# EAGLE design main (EAGLE 9.6.2)
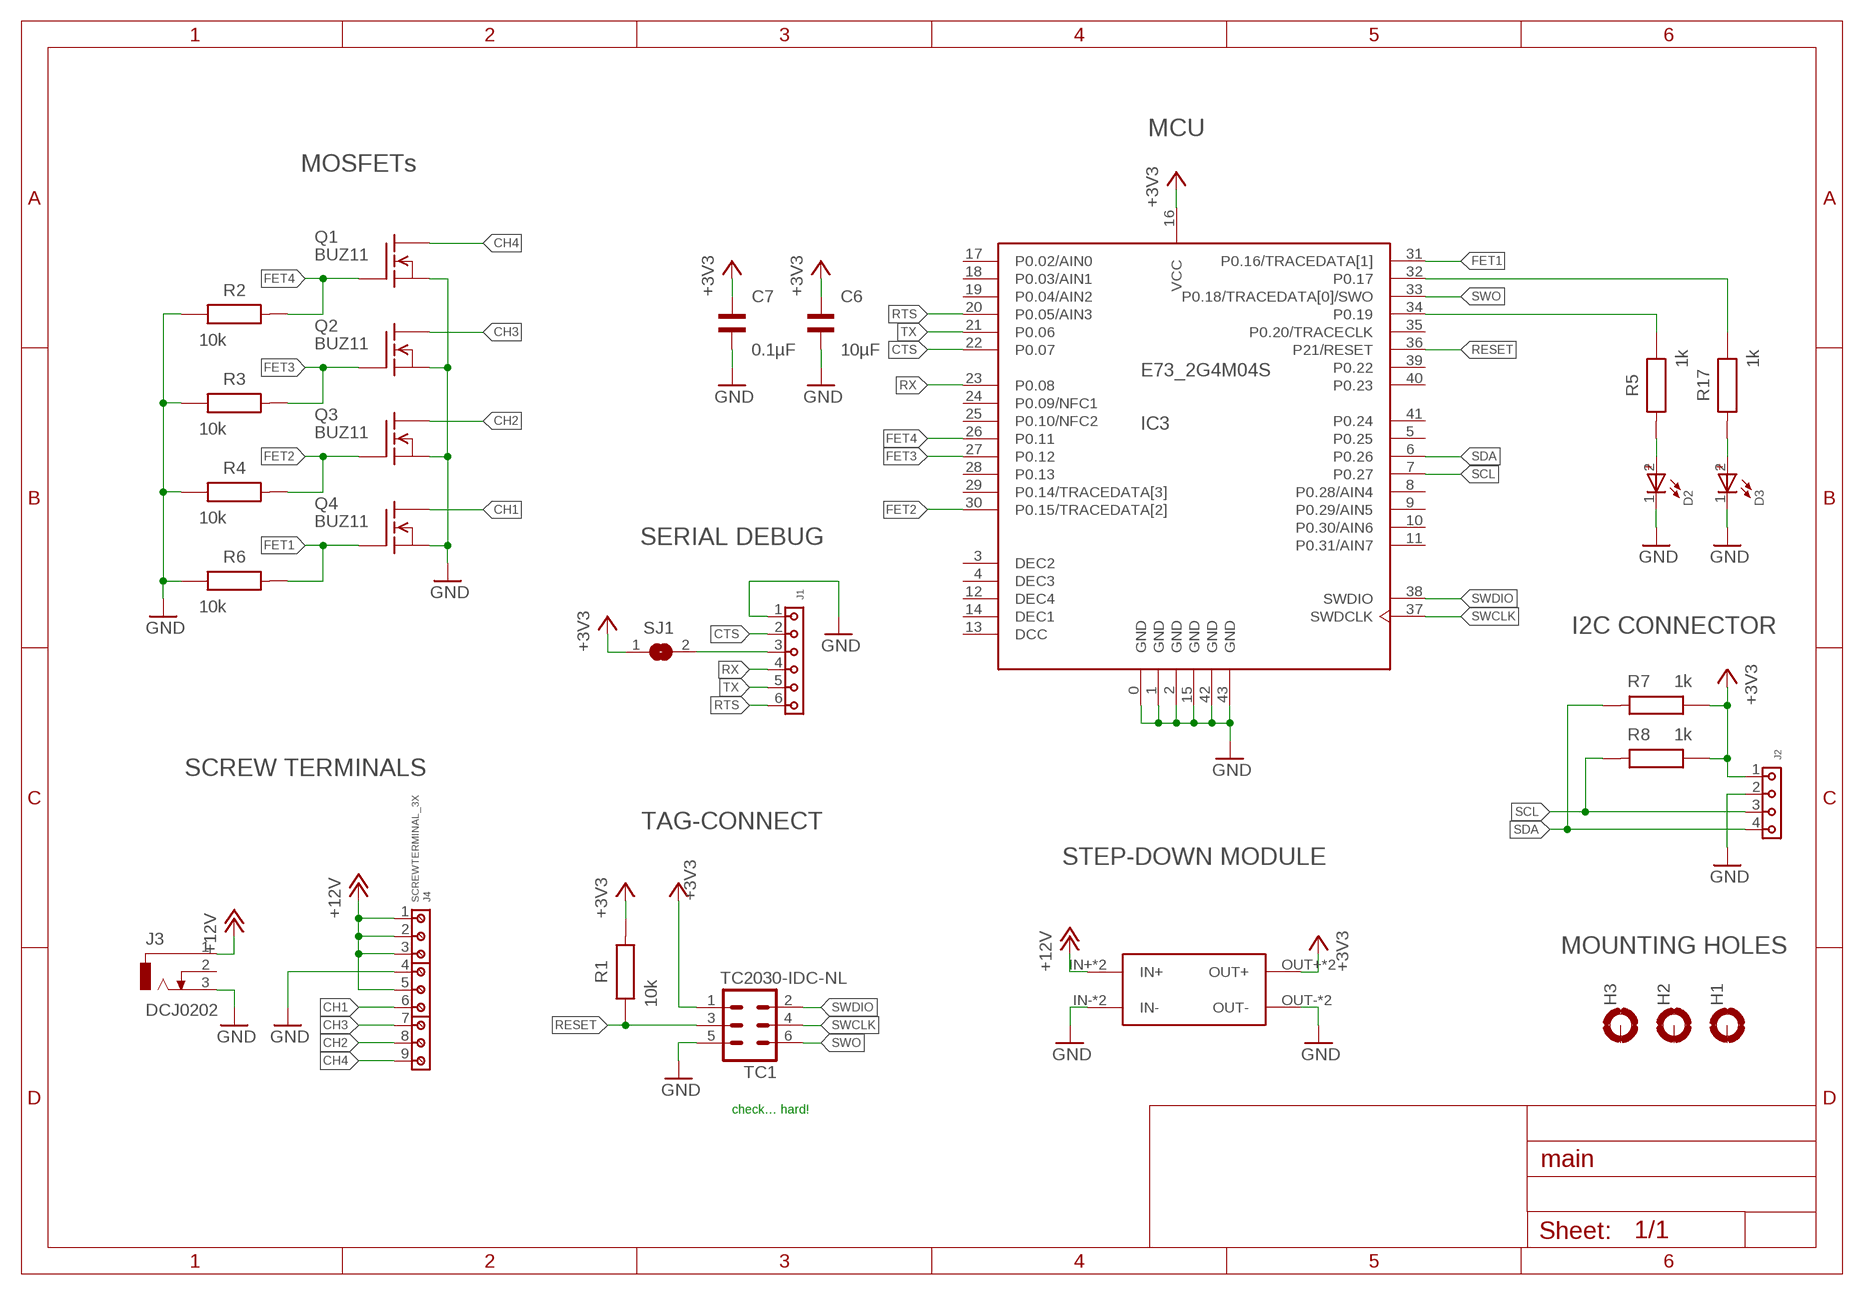
[diagram p0: schematic, sheet 1]

## Parts
C6  10µF  WCAP-CSGP_0603_885012206046_REFLOW  [WCAP-CSGP_0603_REFLOW]
C7  0.1µF  WCAP-CSGP_0603_885012206046_REFLOW  [WCAP-CSGP_0603_REFLOW]
D2  WL-SMCW_0603_150060BS75000  [WL-SMCW_0603]
D3  WL-SMCW_0603_150060BS75000  [WL-SMCW_0603]
H1  MOUNT-PAD-ROUND3.2  [3,2-PAD]
H2  MOUNT-PAD-ROUND3.2  [3,2-PAD]
H3  MOUNT-PAD-ROUND3.2  [3,2-PAD]
IC3  E73_2G4M04S  [E73_2G4M04S]
J1  6130XX11821_61300611821  [61300611821]
J2  6130XX11821_61300411821  [61300411821]
J3  DCJ0202  [DCJ0202]
J4  SCREWTERMINAL_3X  [691102710003]
Q1  BUZ11  [TO220]
Q2  BUZ11  [TO220]
Q3  BUZ11  [TO220]
Q4  BUZ11  [TO220]
R1  10k  WRIS-PSMB_0603_580060716001_1.6X0.8X0.35X0.6  [WRIS-PSMB_0603_1.6X0.8X0.35X0.6(LXWXHXPW)]
R2  10k  WRIS-PSMB_0603_580060716001_1.6X0.8X0.35X0.6  [WRIS-PSMB_0603_1.6X0.8X0.35X0.6(LXWXHXPW)]
R3  10k  WRIS-PSMB_0603_580060716001_1.6X0.8X0.35X0.6  [WRIS-PSMB_0603_1.6X0.8X0.35X0.6(LXWXHXPW)]
R4  10k  WRIS-PSMB_0603_580060716001_1.6X0.8X0.35X0.6  [WRIS-PSMB_0603_1.6X0.8X0.35X0.6(LXWXHXPW)]
R5  1k  WRIS-PSMB_0603_580060716001_1.6X0.8X0.35X0.6  [WRIS-PSMB_0603_1.6X0.8X0.35X0.6(LXWXHXPW)]
R6  10k  WRIS-PSMB_0603_580060716001_1.6X0.8X0.35X0.6  [WRIS-PSMB_0603_1.6X0.8X0.35X0.6(LXWXHXPW)]
R7  1k  WRIS-PSMB_0603_580060716001_1.6X0.8X0.35X0.6  [WRIS-PSMB_0603_1.6X0.8X0.35X0.6(LXWXHXPW)]
R8  1k  WRIS-PSMB_0603_580060716001_1.6X0.8X0.35X0.6  [WRIS-PSMB_0603_1.6X0.8X0.35X0.6(LXWXHXPW)]
R17  1k  WRIS-PSMB_0603_580060716001_1.6X0.8X0.35X0.6  [WRIS-PSMB_0603_1.6X0.8X0.35X0.6(LXWXHXPW)]
SJ1  SJ  [SJ]
TC1  TC2030-IDC-NL  [TC2030-IDC-NL]
U$1  LM2596-MODULE  [LM2596-MODULE]

## Nets
+3V3: C6.2 C7.2 IC3.16(VCC) J2.1 R1.2 R7.1 R8.1 SJ1.1 TC1.1 U$1.OUT+ U$1.OUT+1(OUT+)
+12V: J3.1 J4.1 J4.2 J4.3 J4.5 U$1.IN+ U$1.IN+1(IN+)
CH1: J4.6 Q4.2(D)
CH2: J4.8 Q3.2(D)
CH3: J4.7 Q2.2(D)
CH4: J4.9 Q1.2(D)
CTS: IC3.22(P0.07) J1.2
FET1: IC3.31(P0.16/TRACEDATA[1]) Q4.1(G) R6.2
FET2: IC3.30(P0.15/TRACEDATA[2]) Q3.1(G) R4.2
FET3: IC3.27(P0.12) Q2.1(G) R3.2
FET4: IC3.26(P0.11) Q1.1(G) R2.2
GND: C6.1 C7.1 D2.1(-) D3.1(-) IC3.0(GND) IC3.1(GND) IC3.2(GND) IC3.15(GND) IC3.42(GND) IC3.43(GND) J1.1 J2.2 J3.3 J4.4 Q1.3(S) Q2.3(S) Q3.3(S) Q4.3(S) R2.1 R3.1 R4.1 R6.1 TC1.5 U$1.IN- U$1.IN-1(IN-) U$1.OUT- U$1.OUT-1(OUT-)
N$4: J1.3 SJ1.2
N$18: D2.2(+) R5.2
N$19: D3.2(+) R17.2
N$20: IC3.32(P0.17) R17.1
N$21: IC3.34(P0.19) R5.1
RESET: IC3.36(P21/RESET) R1.1 TC1.3
RTS: IC3.20(P0.05/AIN3) J1.6
RX: IC3.23(P0.08) J1.4
SCL: IC3.7(P0.27) J2.3 R8.2
SDA: IC3.6(P0.26) J2.4 R7.2
SWCLK: IC3.37(SWDCLK) TC1.4
SWDIO: IC3.38(SWDIO) TC1.2
SWO: IC3.33(P0.18/TRACEDATA[0]/SWO) TC1.6
TX: IC3.21(P0.06) J1.5
Unconnected: H1.B3,2(MOUNT) H2.B3,2(MOUNT) H3.B3,2(MOUNT) IC3.5(P0.25) IC3.8(P0.28/AIN4) IC3.9(P0.29/AIN5) IC3.10(P0.30/AIN6) IC3.11(P0.31/AIN7) IC3.17(P0.02/AIN0) IC3.18(P0.03/AIN1) IC3.19(P0.04/AIN2) IC3.24(P0.09/NFC1) IC3.25(P0.10/NFC2) IC3.28(P0.13) IC3.29(P0.14/TRACEDATA[3]) IC3.35(P0.20/TRACECLK) IC3.39(P0.22) IC3.40(P0.23) IC3.41(P0.24) J3.2

## Notes on the sheet
- MCU
- MOSFETs
- SERIAL DEBUG
- I2C CONNECTOR
- SCREW TERMINALS
- TAG-CONNECT
- STEP-DOWN MODULE
- MOUNTING HOLES
- check… hard!

## Power pins joined to a net without a drawn wire
DCC: IC3.13(DCC)
DEC1: IC3.14(DEC1)
DEC2: IC3.3(DEC2)
DEC3: IC3.4(DEC3)
DEC4: IC3.12(DEC4)

## Library data of the parts
C6 C7 = 885012206052_Eagle_WCAP-CSGP_rev19b (1):WCAP-CSGP_0603: WCAP-CSGP Ceramic Capacitors Characteristics Multilayer Ceramic Chip Capacitor Recommended soldering:Reflow, for 0603 and 0805 wave soldering is also allowed Operating temperature:-55 °C to +125 °C; Ceramic characteristics: Class I - NPO ; Class II -X7R, X5R High performance ceramic High capacitance stability Minimal aging Termination:Cu/Ni/Sn <http://katalog.we-online.de/media/images/eisos/WCAP-CSGP_pf2.jpg> Details see: http://katalog.we-online.de/en/pbs/WCAP-CSGP-0603? Created: 2015-01-28 2015 (C) Wurth Elektronik
D2 D3 = 150080BS75000_Eagle_WL-SMCW_rev20b:WL-SMCW_0603: WL-SMCW SMT Mono-color Chip LED Waterclea Characteristics Low energy consumption High reliability Low current requirement Fast switching No UV/IR radiation Smallest SMD LED package for exceptional brightness Top view LED Wide viewing angle Better solder ability Heat dissipation Applications Backlight for mobile and portable device keypads Indoor and outdoor message boards Flat backlight for LCDs, switches and symbols Display for industrial control systems and traffic Miniaturized color effects Pedestrian mark Optical indicators Tabular backlight: LCD, telephone key-press, power-switch, display board Indoor displays Signals Identifiers Backlight for automobile DVD LED General lighting Toys <https://www.we-online.com/catalog/media/o14904v209%20Family_WL-SMCW.jpg> Details see: https://www.we-online.com/catalog/en/WL-SMCW/ Updated BY Yingchun,Shan 2020-03-18 2020(C) Wurth Elektronik; ABSTRAHLWINKEL: 140°; CHIP-TECHNOLOGY: InGaN; DATASHEET-URL: https://www.we-online.com/catalog/datasheet/150060BS75000.pdf; EMITTING-COLOR: Blue; I-V-TYP: 145mcd; LAMDA-DOM-TYP: 470nm; LAMDA-PEAK-TYP: 465nm; PART-NUMBER: 150060BS75000; V-F-TYP: 3.2V
H1-H3 = holes:MOUNT-PAD-ROUND: MOUNTING PAD, round
IC3 = E73-2G4M04S:E73_2G4M04S: E73-2G4M04S nRF52832 based BLE module
J1 = 61300611821_Eagle_WR-PHD_rev19a:6130XX11821_61300611821: WR-PHD 2.54 mm Socket Header ARTICLE PROPERTIES: Pins:1;​ 2;​ 3;​ 4;​ 5;​ 6;​ 7;​ 8;​ 9;​ 10;​ 12;​ 13;​ 14;​ 15;​ 16;​ 18;​ 20;​ 22;​ 24;​ 25;​ 32;​ 36;​ 40 KIND PROPERTIES: Pitch：2.54 mm Quality Class:3 as per CECC 75 301-802 Rows：Single Gender：Socket Header;​ Female Type：Straight MATERIAL PROPERTIES: Insulator Material :PBT Insulator Flammability Rating:UL94 V-0 Contact Material:Copper Alloy Contact Plating:Gold Contact Type:Stamped GENERAL INFORMATION Operating Temperature:-40 up to +125 °C Compliance:Lead free / RoHS ELECTRICAL PROPERTIES: Rated Current:3 A IR 1:3 A Withstanding Voltage:500 V (AC) Contact Resistance:20 mΩ RISO:1000 MΩ CERTIFICATION UL Approval:E323964 PACKAGING PROPERTIES Packaging:Tray <https://katalog.we-online.com/media/images/v2/o33218v209%20Family_WR-PHD_613xxx11821.jpg> Details see: https://katalog.we-online.com/en/em/PHD_2_54_SOCKET_HEADER_6130XX11821 Updated by Yingchun,Shan 2019-10-21 2019 (C) Würth Elektronik; DATASHEET-URL: https://katalog.we-online.com/em/datasheet/61300611821.pdf; GENDER: Socket Header; IR: 3A; MATES: WR-PHD 2.54mm SMT Pin Header/THT Angled Pin Header/THT Pin Header; PACKAGING: Tray; PART-NUMBER: 61300611821; PINS: 6; ROWS: Single; TYPE: Straight
J2 = 61300611821_Eagle_WR-PHD_rev19a:6130XX11821_61300411821: WR-PHD 2.54 mm Socket Header ARTICLE PROPERTIES: Pins:1;​ 2;​ 3;​ 4;​ 5;​ 6;​ 7;​ 8;​ 9;​ 10;​ 12;​ 13;​ 14;​ 15;​ 16;​ 18;​ 20;​ 22;​ 24;​ 25;​ 32;​ 36;​ 40 KIND PROPERTIES: Pitch：2.54 mm Quality Class:3 as per CECC 75 301-802 Rows：Single Gender：Socket Header;​ Female Type：Straight MATERIAL PROPERTIES: Insulator Material :PBT Insulator Flammability Rating:UL94 V-0 Contact Material:Copper Alloy Contact Plating:Gold Contact Type:Stamped GENERAL INFORMATION Operating Temperature:-40 up to +125 °C Compliance:Lead free / RoHS ELECTRICAL PROPERTIES: Rated Current:3 A IR 1:3 A Withstanding Voltage:500 V (AC) Contact Resistance:20 mΩ RISO:1000 MΩ CERTIFICATION UL Approval:E323964 PACKAGING PROPERTIES Packaging:Tray <https://katalog.we-online.com/media/images/v2/o33218v209%20Family_WR-PHD_613xxx11821.jpg> Details see: https://katalog.we-online.com/en/em/PHD_2_54_SOCKET_HEADER_6130XX11821 Updated by Yingchun,Shan 2019-10-21 2019 (C) Würth Elektronik; DATASHEET-URL: https://katalog.we-online.com/em/datasheet/61300411821.pdf; GENDER: Socket Header; IR: 3A; MATES: WR-PHD 2.54mm SMT Pin Header/THT Angled Pin Header/THT Pin Header; PACKAGING: Tray; PART-NUMBER: 61300411821; PINS: 4; ROWS: Single; TYPE: Straight
J3 = con-jack:DCJ0202: DC POWER JACK Source: DCJ0202.pdf; OC_FARNELL: unknown; OC_NEWARK: unknown
J4 = Eigene Bauteile:SCREWTERMINAL_3X
Q1-Q4 = transistor-fet:BUZ11: N-Channel Enhancement MOSFET 50V; 30A; 0,040Ohm
R1-R8 R17 = 580060716001_Eagle_WRIS-PSMB_rev19a:WRIS-PSMB_0603: WRIS-PSMB Metal Plate Resistors Characteristics Metal plate resistors Recommended soldering: Reflow Operating temperature: -55 °C up to +155 °C Resistance range: 5 mΩ up to 10 mΩ Resistance tolerance: ±1 % Rated power: 0.33 W up to 1 W Enhanced current sensing Applications DMotor control Package name and Variant abbreviation: L X W X H X PW =Length X Width X Height X Pad Width <https://katalog.we-online.com/media/images/v2/o135743v209%20Family_WRIS-PSMB.jpg> Details see: https://katalog.we-online.com/en/pbs/WRIS-PSMB Created by Yingchun, Shan 2018-11-14 2018(C) Wurth Elektronik; DATASHEET-URL: https://katalog.we-online.de/pbs/datasheet/580060716001.pdf; IR: 8.12A; MOUNT: SMT; PART-NUMBER: 580060716001; PRATED: 0.33W; TCR: ±100ppm/ °C; TECHNICAL-REFERENCE: MB0603R005F103KAATP0000; VALUE: 5mOhm
SJ1 = jumper:SJ: SMD solder JUMPER
TC1 = TagConnect:TC2030-IDC: Tag-Connect In Circuit Programming & Debug Cable 6 Pin http://www.tag-connect.com
U$1 = Lib_A:LM2596-MODULE

## Board
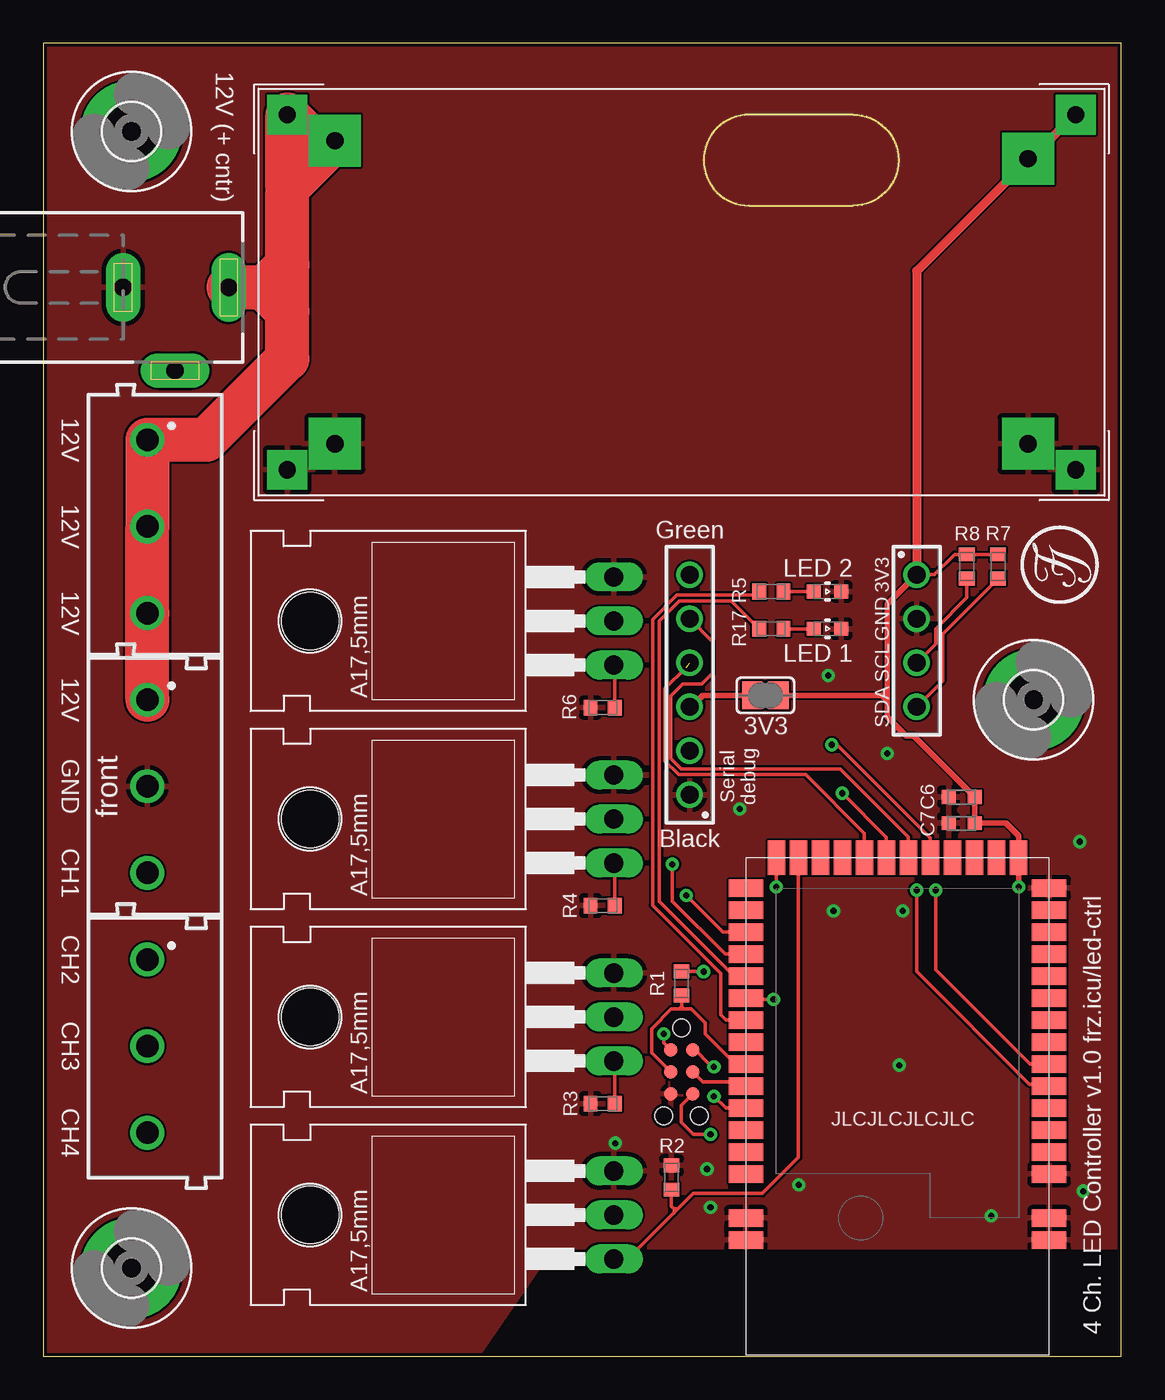
[diagram p1: board, top side]
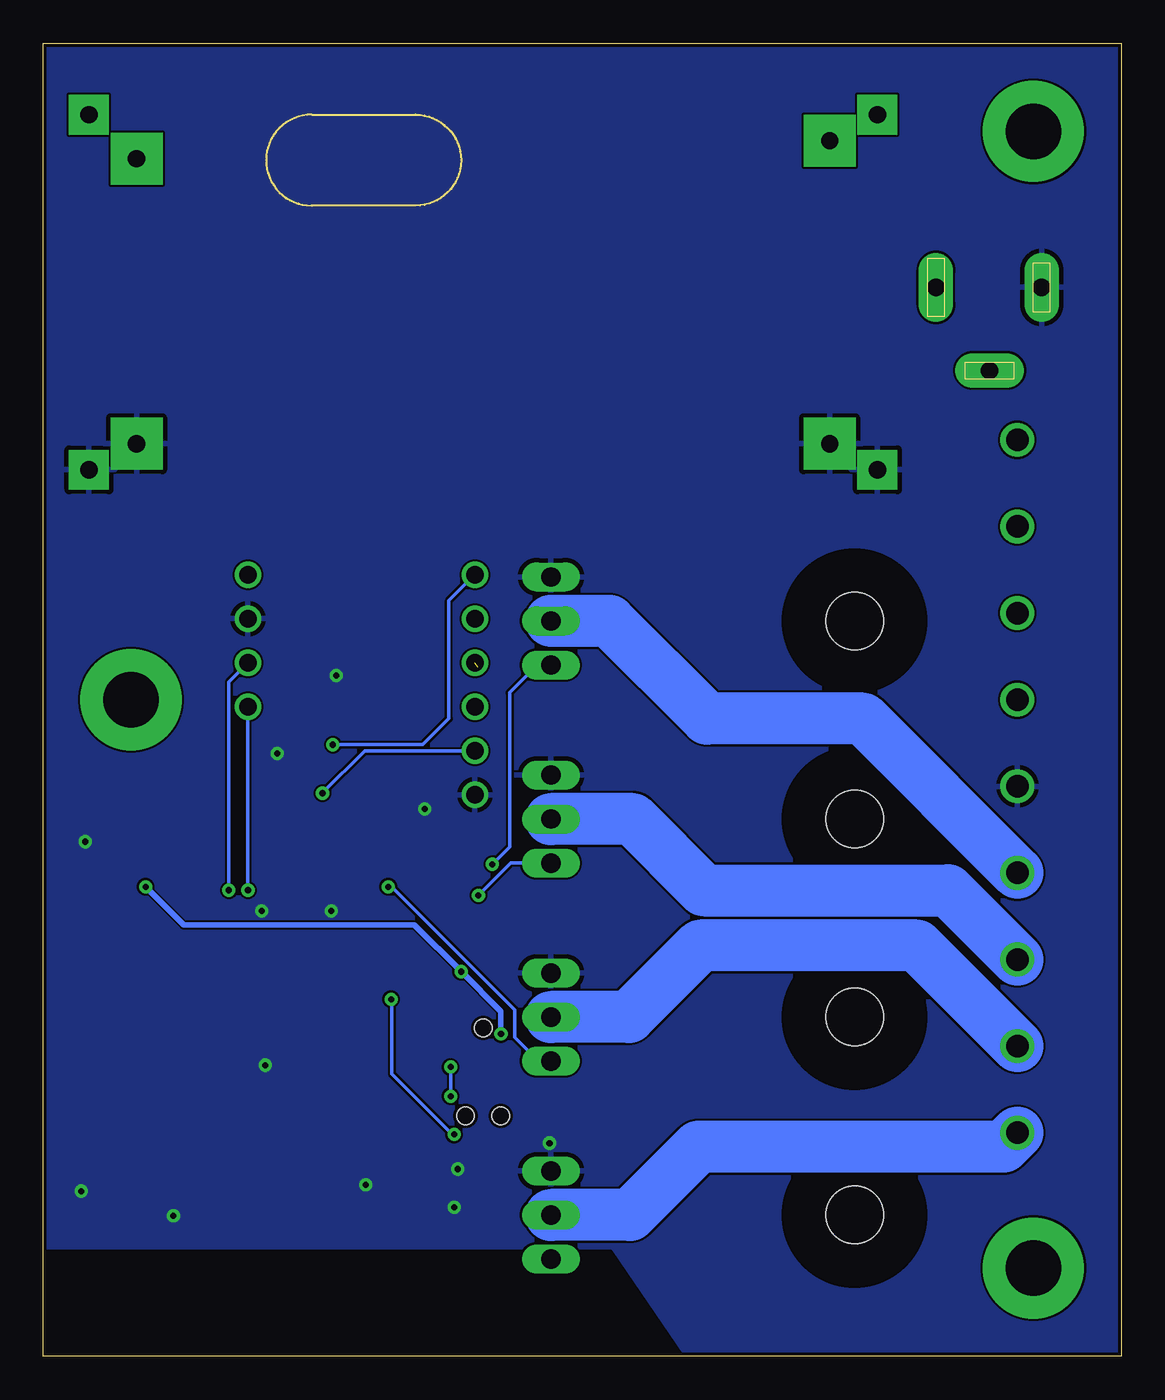
[diagram p2: board, bottom side, seen from below]

Size 62.21 x 75.79 mm. Coordinates in mm from the lower left corner, seen from the top.
Outline: 0,0 62.21,0 62.21,75.79 0,75.79 0,0
Copper layers (1*16): Top 0.035mm / dielectric 1.5mm / Bottom 0.035mm
Design rules "default *": minimum track width 6mil, minimum drill 0.35mm, track to track 5mil, track to pad 6mil, pad to pad 6mil, via to via 6mil, smd to smd 6mil, copper to edge 0.2mm, drill to drill 6mil, minimum pad ring 10mil, minimum via ring 8mil, stop-mask expansion 4mil, vias tented up to drill 100mil, thermal gap 10mil
tRestrict: area 25.3,-0.1 to 62.3,6
bRestrict: area 25.3,-0.1 to 62.3,6

### Footprints (pad centres in the part's own frame; a part is rotated, then mirrored left to right if it is on the bottom)
WCAP-CSGP_0603_REFLOW = smd 0.8 x 0.8: 1 -0.75,0; 2 0.75,0
WL-SMCW_0603 = smd 0.8 x 0.8: 1 -0.8,0; 2 0.8,0
3,2-PAD = drill 3.2 pad 5.842: B3,2 0,0
E73_2G4M04S = smd 1 x 2: 0 22.065,17.5; 1 20.795,17.5; 2 18.255,17.5; 3 16.985,17.5; 4 15.715,17.5; 5 14.445,17.5; 6 13.175,17.5; 7 11.905,17.5; 8 10.635,17.5; 9 9.365,17.5; 10 8.095,17.5; 11 6.825,17.5; 12 5.555,17.5; 13 4.285,17.5; 14 3.015,17.5; 15 1.745,17.5; 28 1.745,0; 29 3.015,0; 30 4.285,0; 31 5.555,0; 32 6.825,0; 33 8.095,0; 34 9.365,0; 35 10.635,0; 36 11.905,0; 37 13.175,0; 38 14.445,0; 39 15.715,0; 40 16.985,0; 41 18.255,0; 42 20.795,0; 43 22.065,0 | smd 2 x 1: 16 0,15.735; 17 0,14.465; 18 0,13.195; 19 0,11.925; 20 0,10.655; 21 0,9.385; 22 0,8.115; 23 0,6.845; 24 0,5.575; 25 0,4.305; 26 0,3.035; 27 0,1.765
61300611821 = drill 1.02: 1 -6.35,0; 2 -3.81,0; 3 -1.27,0; 4 1.27,0; 5 3.81,0; 6 6.35,0
61300411821 = drill 1.02: 1 -3.81,0; 2 -1.27,0; 3 1.27,0; 4 3.81,0
DCJ0202 = drill 1 pad 2 long: 1 0,3.1; 2 4.8,0; 3 0,-3
691102710003 = drill 1.3: 1 -20,0; 2 -15,0; 3 -10,0; 4 0,0; 5 -5,0; 6 5,0; 7 15,0; 8 10,0; 9 20,0
TO220 = drill 1.118 long: 1 -2.54,-6.35; 2 0,-6.35; 3 2.54,-6.35 | hole 3.302: 0,11.176
WRIS-PSMB_0603_1.6X0.8X0.35X0.6(LXWXHXPW) = smd 0.8 x 0.9: 1 -0.7,0; 2 0.7,0
SJ = smd 1.168 x 1.6: 1 -0.762,0; 2 0.762,0
TC2030-IDC-NL = smd 0.787 x 0.787: 1 -1.27,-0.635; 2 -1.27,0.635; 3 0,-0.635; 4 0,0.635; 5 1.27,-0.635; 6 1.27,0.635 | hole 0.991: -2.54,0; 2.54,1.016; 2.54,-1.016
LM2596-MODULE = drill 1 pad 2.3 square: IN+ -22.75,10.25; IN- -22.75,-10.25; OUT+ 22.75,10.25; OUT- 22.75,-10.25 | drill 1 pad 3 square: IN+1 -20,8.75; IN-1 -20,-8.75; OUT+1 20,7.71; OUT-1 20,-8.75

### Placement (x,y rotation side)
C6  52.99,32.29 0 top
C7  52.99,30.77 0 top
D2  45.25,44.14 180 top
D3  45.25,41.99 180 top
H1  5.08,5.08 0 top
H2  57.15,37.9 0 top
H3  5.08,70.71 0 top
IC3  40.54,28.77 270 top
J1  37.3,38.76 90 top
J2  50.4,41.3 270 top
J3  7.6,61.7 270 top
J4  6,32.9 270 top
Q1  26.57,8.15 90 top
Q2  26.57,19.58 90 top
Q3  26.57,31.01 90 top
Q4  26.57,42.44 90 top
R1  36.83,21.52 90 top
R2  36.25,10.32 270 top
R3  32.28,14.58 0 top
R4  32.28,26.01 0 top
R5  42.01,44.14 0 top
R6  32.28,37.44 0 top
R7  55.1,45.59 270 top
R8  53.29,45.59 270 top
R17  42.01,41.99 0 top
SJ1  41.67,38.15 180 top
TC1  36.83,16.41 270 top
U$1  36.83,61.42 0 top

### Tracks (layer width: path | path; a pad name or v marks a point on that pad's centre or on a via)
+3V3  (via drill 0.35)
  Top 0.203: R7.1 R8.1 52.59,46.29 51.41,45.11 J2.1 | TC1.1 36.2,17.7 35.8,18.1 v35.8,18.6 | v38.1,22.2 36.85,22.2 R1.2 | U$1.OUT+1 56.83,69.07 55.83,68.07
  Top 0.305: IC3.16 56.23,28.73 56.23,28.37 | J2.1 48.7,43.41 48.7,38.45 | SJ1.1 48.4,38.15 | IC3.16 56.3,28.75 v56.3,27.1 | U$1.OUT+1 56.83,68.99 | 48.4,38.15 48.7,38.45 | 48.4,38.15 48.7,37.85 | 48.7,37.85 48.7,36.9 49.8,35.8 50.23,35.8 C6.2 C7.2 55.53,30.77 56.27,30.02 IC3.16 | 48.7,37.85 48.7,38.45
  Top 0.508: U$1.OUT+ 59.51,71.67 56.83,68.99 | 55.83,68.07 50.4,62.64 J2.1
  Bottom 0.305: v35.8,18.6 35.8,19.9 v38.1,22.2 40.8,24.9 54.1,24.9 v56.3,27.1
+12V
  Top 2.54: J4.5 J4.3 J4.2 J4.1 9.4,52.9 14.08,57.58 14.08,60.3 | 14.08,60.3 14.08,63 | 14.08,63 14.08,67.2 14.08,67.42 | 14.08,67.42 U$1.IN+ 15.58,70.17 U$1.IN+1 14.08,67.42 | J3.1 12.78,61.7 | 12.78,61.7 14.08,63 | 12.78,61.7 12.78,61.6 14.08,60.3
CH1
  Bottom 3: J4.6 14.9,36.8 23.9,36.8 29.54,42.44 Q4.2
CH2
  Bottom 3: Q3.2 28.21,31.01 24.1,26.9 10,26.9 J4.8
CH3
  Bottom 3: J4.7 11.8,23.7 24.3,23.7 28.42,19.58 Q2.2
CH4
  Bottom 3: J4.9 6.81,12.09 24.41,12.09 28.35,8.15 Q1.2
CTS  (via drill 0.35)
  Top 0.203: IC3.22 48.66,29.95 v46.1,32.5
  Bottom 0.203: v46.1,32.5 43.65,34.95 J1.2
FET1  (via drill 0.35)
  Top 0.203: Q4.1 32.98,39.84 R6.2 | IC3.31 39.34,23.21 36.3,26.25 v36.3,28.4
  Bottom 0.203: v36.3,28.4 35.3,29.4 35.3,38.3 33.7,39.9 Q4.1
FET2  (via drill 0.35)
  Top 0.203: R4.2 32.98,28.3 | 32.98,28.3 32.98,28.41 Q3.1 | 33.08,28.4 32.98,28.3 | IC3.30 39.22,24.48 v37.1,26.6
  Bottom 0.203: Q3.1 35.23,28.47 v37.1,26.6
FET3  (via drill 0.35)
  Top 0.203: Q2.1 32.98,16.98 R3.2 | v42.3,27.1 IC3.27
  Bottom 0.203: Q2.1 33.64,17.04 35,18.4 35,20 42.1,27.1 v42.3,27.1
FET4
  Top 0.152: 36.51,8.39 36.4,8.5 | 36.4,8.29 36.35,8.24 | 36.6,8.5 36.6,8.49
  Top 0.203: IC3.26 43.58,11.47 41.5,9.4 37.51,9.4 36.6,8.49 36.51,8.39 36.35,8.24 33.72,5.61 Q1.1 | R2.2 36.25,8.65 36.4,8.5 | 36.4,8.5 36.4,8.29 | 36.4,8.5 36.6,8.5
GND  (via drill 0.35)
  other vias: 48.7,34.8 38.3,10.8 33,12.3 43.6,9.9 49.4,16.8 54.7,8.1 60.01,9.53 45.6,25.7 49.6,25.7 59.8,29.7 40.2,31.6 38.5,8.6 45.3,39.3
  pour Top: 0,0 62.2,0 62.2,75.8 0,75.8
  pour Bottom: 0.1,-0.1 62.3,-0.1 62.3,75.7 0.2,75.7 0.1,75.6
N$4
  Top 0.305: J1.3 37.4,37.49 38.06,38.15 SJ1.2
N$18
  Top 0.203: R5.2 D2.2
N$19
  Top 0.203: R17.2 D3.2
N$20
  Top 0.203: R17.1 39.7,43.6 36.7,43.6 35.54,42.44 35.54,26.26 40.2,21.6 IC3.32
N$21
  Top 0.203: R5.1 41.31,44.11 41.13,43.93 36.56,43.93 35.17,42.53 35.17,26.03 39.1,22.09 39.1,19.7 39.4,19.41 IC3.34
RESET
  Top 0.203: TC1.3 35.1,17.5 35.1,18.91 36.25,20.05 36.7,20.05 | IC3.36 39.94,16.86 38.2,18.6 38.2,19.25 37.4,20.05 36.96,20.05 | 36.7,20.05 36.96,20.05 | R1.1 36.83,20.18 | 36.83,20.18 36.7,20.05 | 36.83,20.18 36.96,20.05
RTS  (via drill 0.35)
  Top 0.203: v45.5,35.3 45.8,35.3 51.2,29.91 IC3.20
  Bottom 0.203: v45.5,35.3 40.3,35.3 38.8,36.8 38.8,43.61 J1.6
RX  (1 unrouted)
  Top 0.203: IC3.23 47.38,30.18 44,33.57 36.66,33.57 35.87,34.36 35.87,38.54 37.1,39.77
SCL  (via drill 0.35)
  Top 0.203: J2.3 51.49,41.12 51.49,41.99 53.29,43.79 R8.2 | IC3.7 56.94,16.86 51.5,22.3 v51.5,26.9
  Bottom 0.203: J2.3 51.5,38.93 v51.5,26.9
SDA  (via drill 0.35)
  Top 0.203: J2.4 51.9,38.99 51.9,41.69 R7.2 | v50.4,26.9 50.4,22.2 56.91,15.7 57.94,15.7 IC3.6
  Bottom 0.203: v50.4,26.9 J2.4
SWCLK
  Top 0.203: IC3.37 40.54,15.65 40.36,15.83 38.04,15.83 TC1.4
SWDIO  (via drill 0.35)
  Top 0.203: v38.7,16.7 38.6,16.8 38.5,16.8 37.62,17.68 TC1.2 | IC3.38 39.38,14.32 v38.7,15
  Bottom 0.203: v38.7,16.7 v38.7,15
SWO  (via drill 0.35)
  Top 0.203: TC1.6 36.8,14.47 36.8,13.5 37.5,12.8 v38.5,12.8 | IC3.33 40.47,20.6 v42.14,20.6
  Bottom 0.203: v38.5,12.8 38.6,12.8 42.1,16.3 42.1,20.56 v42.14,20.6
TX
  Top 0.203: IC3.21 49.92,29.98 46,33.9 36.8,33.9 36.2,34.5 36.2,38.1 36.9,38.8 38,38.8 38.6,39.4 38.6,41.27 J1.5

### Text on the board
tNames: 12V (+ cntr) | 12V | 12V | Green | LED 2 | 3V3 | 12V | GND | LED 1 | SCL | 12V | 3V3 | SDA | GND | Serial / debug | Black | CH1 | CH2 | CH3 | CH4 | JLCJLCJLCJLC | 4 Ch. LED Controller v1.0 frz.icu/led-ctrl